# Altium schematic sheet Gastroscopy-LED.SchDoc: LED
size 279 x 215 mm; Date: not used; ApprovedBy: not used; CheckedBy: not used; Author: not used; DrawnBy: not used; Organization: not used; Address4: not used; SheetNumber: 3; SheetTotal: 3; Time: not used; ImagePath: not used; Application_BuildNumber: not used
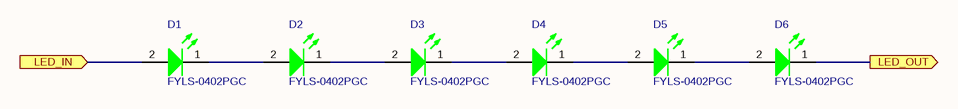
[diagram p0: Gastroscopy-LED.SchDoc]

## Parts
D1  FYLS-0402PGC  [L_0402_GREEN]
D2  FYLS-0402PGC  [L_0402_GREEN]
D3  FYLS-0402PGC  [L_0402_GREEN]
D4  FYLS-0402PGC  [L_0402_GREEN]
D5  FYLS-0402PGC  [L_0402_GREEN]
D6  FYLS-0402PGC  [L_0402_GREEN]

## Ports
LED_IN (in), LED_OUT (out)

## Nets
LED_IN: D1.2(A) ; port LED_IN
LED_OUT: D6.1(K) ; port LED_OUT
NetD1_1: D1.1(K) D2.2(A)
NetD2_1: D2.1(K) D3.2(A)
NetD3_1: D3.1(K) D4.2(A)
NetD4_1: D4.1(K) D5.2(A)
NetD5_1: D5.1(K) D6.2(A)

## Notes on the sheet
- Title:
- Date:
- Size A
- Project:
- Number:
- Time:
- Sheet
- Revision
- of
- Engineer:
- www.mrobots.ru <http://mrobots.ru/>
- File:

## Library data of the parts
D1-D6 = FYLS-0402PGC: LED GREEN CLEAR SMD; Manufacturer 1: Ningbo Foryard Optoelectronics; Manufacturer Part Number 1: FYLS-0402PGC